# EAGLE design SIC (EAGLE 7.2.0)
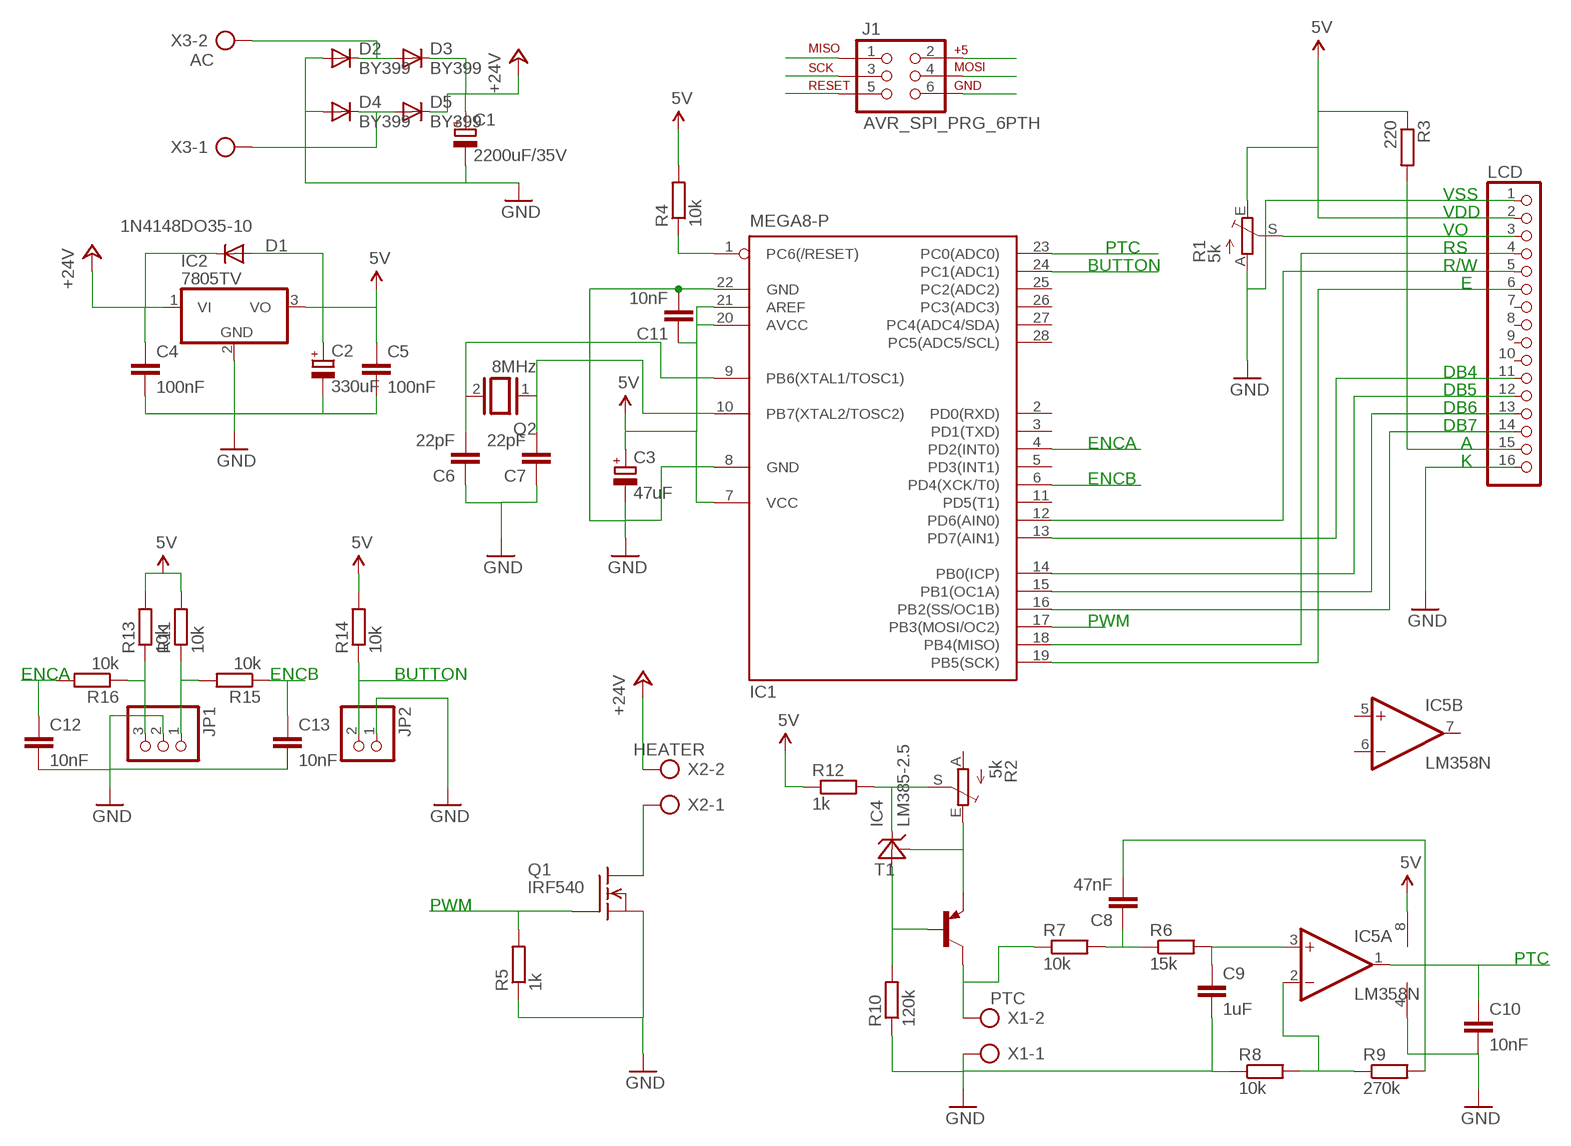
[diagram p0: schematic, sheet 1]

## Parts
C1  2200uF/35V  CPOL-EUE7.5-16  [E7,5-16]
C2  330uF  CPOL-EUE3.5-8  [E3,5-8]
C3  47uF  CPOL-EUE2-5  [E2-5]
C4  100nF  C-EU050-025X075  [C050-025X075]
C5  100nF  C-EU050-025X075  [C050-025X075]
C6  22pF  C-EU050-024X044  [C050-024X044]
C7  22pF  C-EU050-024X044  [C050-024X044]
C8  47nF  C-EU050-025X075  [C050-025X075]
C9  1uF  C-EU050-030X075  [C050-030X075]
C10  10nF  C-EU050-025X075  [C050-025X075]
C11  10nF  C-EU050-025X075  [C050-025X075]
C12  10nF  C-EU050-025X075  [C050-025X075]
C13  10nF  C-EU050-025X075  [C050-025X075]
D1  1N4148DO35-10  [DO35-10]
D2  BY399  BY396  [DO201-15]
D3  BY399  BY396  [DO201-15]
D4  BY399  BY396  [DO201-15]
D5  BY399  BY396  [DO201-15]
IC1  MEGA8-P  [DIL28-3]
IC2  7805TV  [TO220V]
IC4  LM385-2.5  [TO92-]
IC5  LM358N  [DIL08]
J1  AVR_SPI_PRG_6PTH  [2X3]
JP1  PINHD-1X3  [1X03]
JP2  PINHD-1X2  [1X02]
LCD  PINHD-1X16  [1X16]
Q1  IRF540  [TO220]
Q2  8MHz  XTAL/S  [QS]
R1  5k  TRIM_EU-LI10  [LI10]
R2  5k  TRIM_EU-LI10  [LI10]
R3  220  R-EU_0207/10  [0207/10]
R4  10k  R-EU_0207/10  [0207/10]
R5  1k  R-EU_0207/10  [0207/10]
R6  15k  R-EU_0207/10  [0207/10]
R7  10k  R-EU_0207/10  [0207/10]
R8  10k  R-EU_0207/10  [0207/10]
R9  270k  R-EU_0207/10  [0207/10]
R10  120k  R-EU_0207/10  [0207/10]
R11  10k  R-EU_0207/10  [0207/10]
R12  1k  R-EU_0207/10  [0207/10]
R13  10k  R-EU_0207/10  [0207/10]
R14  10k  R-EU_0207/10  [0207/10]
R15  10k  R-EU_0207/10  [0207/10]
R16  10k  R-EU_0207/10  [0207/10]
T1  BC327-16-PNP-TO92-EBC  [TO92-EBC]
X1  PTC  AK300/2  [AK300/2]
X2  HEATER  AK300/2  [AK300/2]
X3  AC  AK300/2  [AK300/2]

## Nets
5V: C2.+ C3.+ C5.1 C11.1 D1.A IC1.7(VCC) IC1.20(AVCC) IC1.21(AREF) IC2.3(VO) IC5.8(P:V+) J1.2 LCD.2 R1.E R3.1 R4.2 R11.2 R12.1 R13.2 R14.2
+24V: C1.+ C4.1 D1.C D3.C D5.C IC2.1(VI) X2.2
BUTTON: IC1.24(PC1(ADC1)) JP2.2 R14.1
ENCA: C12.1 IC1.4(PD2(INT0)) R16.2
ENCB: C13.1 IC1.6(PD4(XCK/T0)) R15.1
GND: C1.- C2.- C3.- C4.2 C5.2 C6.1 C7.1 C9.2 C10.2 C11.2 C12.2 C13.2 D2.A D4.A IC1.8(GND) IC1.22(GND) IC2.2(GND) IC5.4(P:V-) J1.6 JP1.2 JP2.1 LCD.1 LCD.16 Q1.3(S) R1.A R5.1 R8.1 R10.1 X1.1
MISO: IC1.18(PB4(MISO)) J1.1 LCD.4
MOSI_PWM: IC1.17(PB3(MOSI/OC2)) J1.4 Q1.1(G) R5.2
N$1: IC1.13(PD7(AIN1)) LCD.11
N$2: IC1.14(PB0(ICP)) LCD.12
N$3: IC1.15(PB1(OC1A)) LCD.13
N$4: IC1.16(PB2(SS/OC1B)) LCD.14
N$5: LCD.15 R3.2
N$7: C8.1 R6.1 R7.2
N$8: C9.1 IC5.3(A:+IN) R6.2
N$9: Q1.2(D) X2.1
N$10: LCD.3 R1.S
N$11: IC5.2(A:-IN) R8.2 R9.1
N$13: JP1.3 R13.1 R16.1
N$14: D4.C D5.A X3.1
N$15: D2.C D3.A X3.2
N$16: R7.1 T1.C X1.2
N$17: IC4.3(FB) R2.E T1.E
N$18: JP1.1 R11.1 R15.2
N$19: C6.2 IC1.9(PB6(XTAL1/TOSC1)) Q2.2
N$20: C7.2 IC1.10(PB7(XTAL2/TOSC2)) Q2.1
N$21: IC1.12(PD6(AIN0)) LCD.5
N$24: IC4.1(A) R10.2 T1.B
N$25: IC4.2(C) R2.S R12.2
PTC: C8.2 C10.1 IC1.23(PC0(ADC0)) IC5.1(A:OUT) R9.2
RESET: IC1.1(PC6(/RESET)) J1.5 R4.1
SCK: IC1.19(PB5(SCK)) J1.3 LCD.6
Unconnected: IC1.2(PD0(RXD)) IC1.3(PD1(TXD)) IC1.5(PD3(INT1)) IC1.11(PD5(T1)) IC1.25(PC2(ADC2)) IC1.26(PC3(ADC3)) IC1.27(PC4(ADC4/SDA)) IC1.28(PC5(ADC5/SCL)) IC5.5(B:+IN) IC5.6(B:-IN) IC5.7(B:OUT) LCD.7 LCD.8 LCD.9 LCD.10 R2.A

## Notes on the sheet
- VSS
- VDD
- VO
- PTC | RS
- BUTTON | R/W
- E
- DB4
- DB5
- DB6
- DB7
- ENCA | A
- K
- ENCB
- PWM
- ENCA | ENCB | BUTTON
- PWM
- PTC

## Library data of the parts
C1-C3 = rcl:CPOL-EU: POLARIZED CAPACITOR, European symbol
C4-C13 = rcl:C-EU: CAPACITOR, European symbol
D1 = diode:1N4148: DIODE high speed (Philips)
D2-D5 = diode:BY396: DIODE Si,100 V, 3 A
IC1 = atmel:MEGA8-P: MICROCONTROLLER 8 Kbytes FLASH, 1 kbytes SRAM, 512 bytes EEPROM, USART, 4-channel 10 bit ADC, 2-channel 8 bit ADC Pin compatible with Atmega48, ATMega88, ATMega168 Source: avr.lbr; OC_FARNELL: unknown; OC_NEWARK: unknown
IC2 = linear:78*: Positive VOLTAGE REGULATOR Source: http://cache.national.com/ds/LM/LM78L05.pdf http://www.fairchildsemi.com/ds/LM/LM7805.pdf
IC4 = oli:LM385*: LM185/285/385 Adjustable Micropower Voltage Reference Features Adjustable from 1.24 V to 5.30 V Operating current of 10 µA to 20 mA 1 % and 2 % initial tolerance 1 Ω dynamic impedance Low temperature coefficient
IC5 = linear:LM358: OP AMP also LM158; LM258; LM2904 Source: http://cache.national.com/ds/LM/LM158.pdf
J1 = SparkFun:AVR_SPI_PRG_6: AVR ISP 6 Pin This is the reduced ISP connector for AVR programming. Common on Arduino. This footprint will take up less PCB space and can be used with a 10-pin to 6-pin adapter such as SKU: BOB-08508
JP1 = pinhead:PINHD-1X3: PIN HEADER
JP2 = pinhead:PINHD-1X2: PIN HEADER
LCD = pinhead:PINHD-1X16: PIN HEADER
Q1 = transistor-fet:IRF540: N-Channel Enhancement MOSFET (HEXFET); 100V; 28A; 0,077Ohm
Q2 = special:XTAL/S: CRYSTAL
R1 R2 = pot:TRIM_EU-: POTENTIOMETER
R3-R16 = resistor:R-EU_: RESISTOR, European symbol
T1 = transistor:*-PNP-: PNP Transistror
X1-X3 = con-ptr500:AK300/2: CONNECTOR; OC_FARNELL: unknown; OC_NEWARK: unknown

## Board
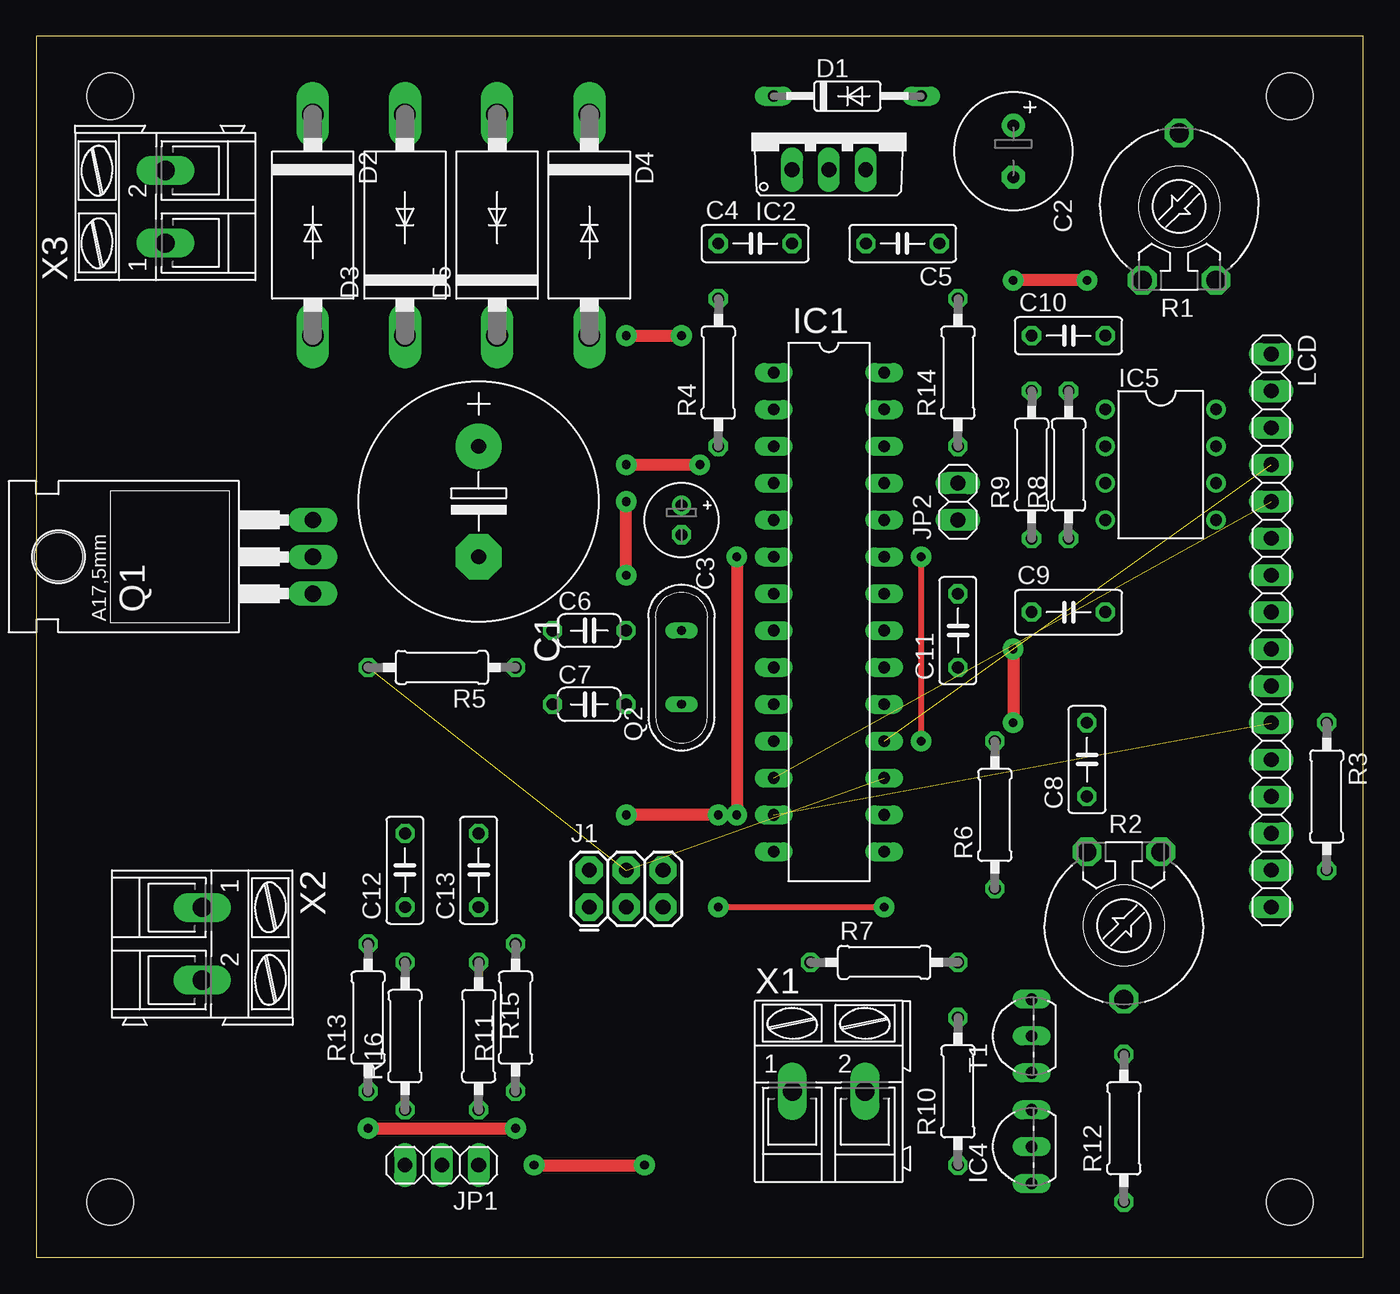
[diagram p1: board, top side]
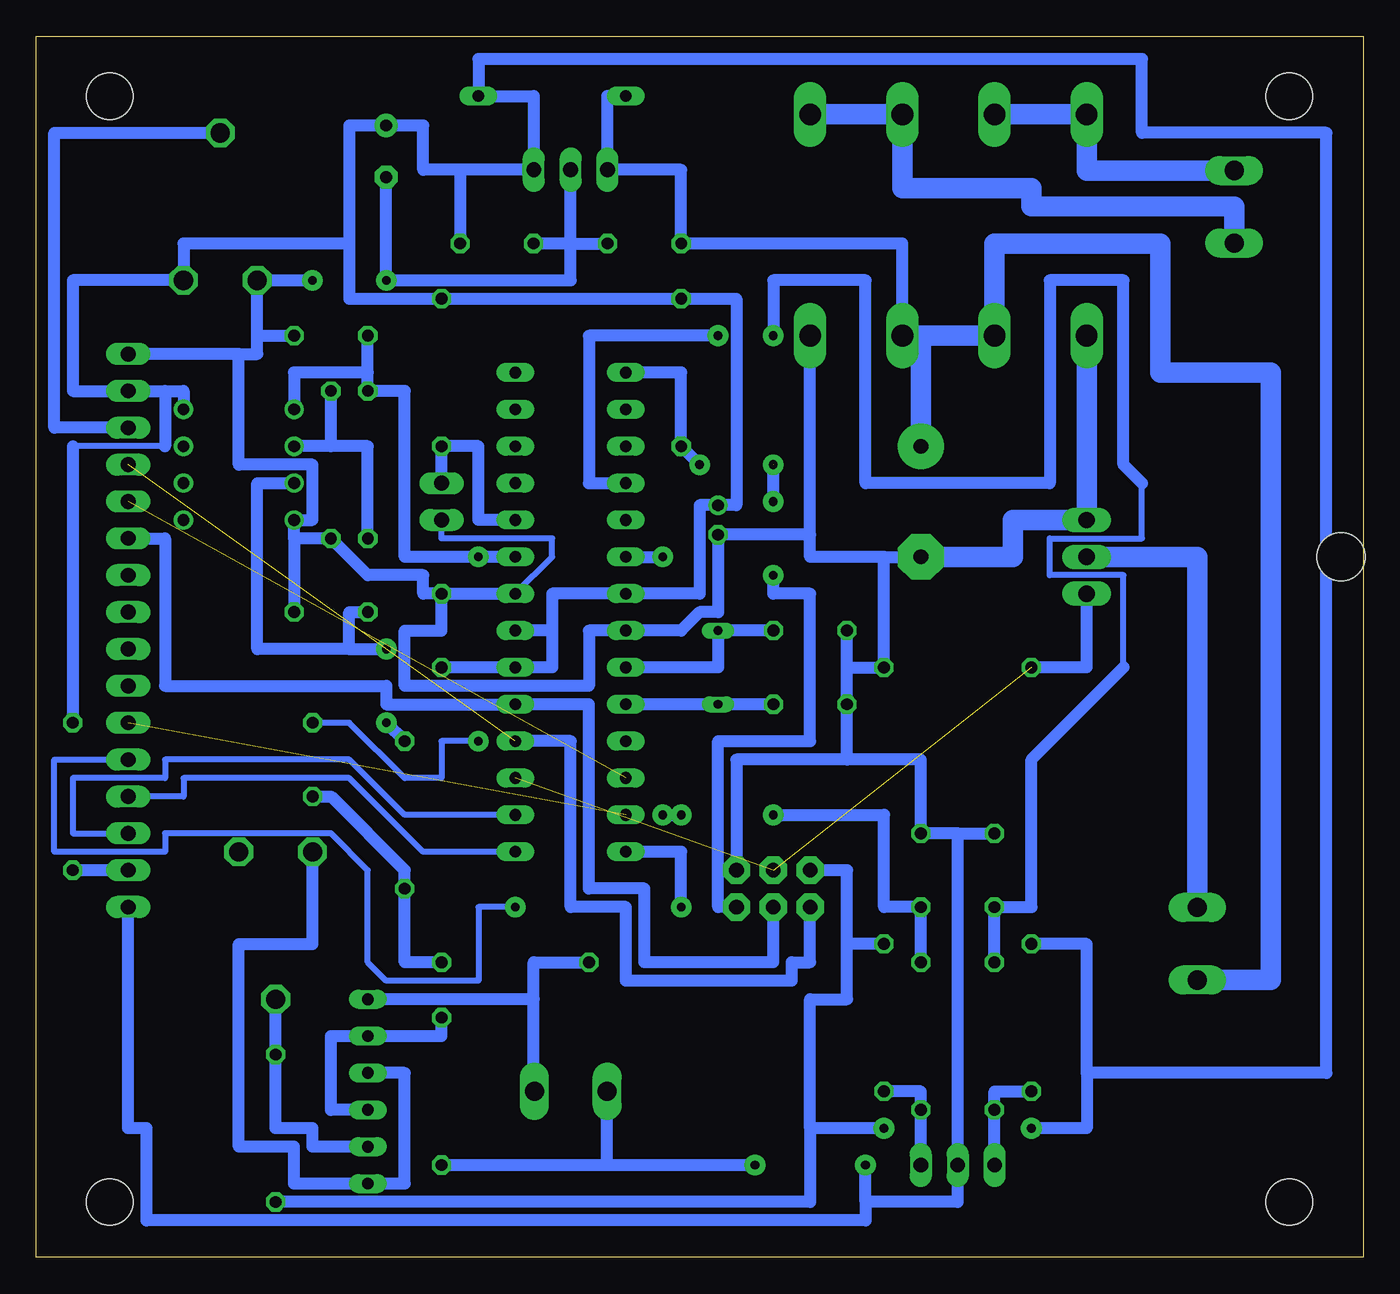
[diagram p2: board, bottom side, seen from below]

Size 91.42 x 84.12 mm. Coordinates in mm from the lower left corner, seen from the top.
Outline: 0,0 91.42,0 91.42,84.12 0,84.12 0,0
Copper layers (1*16): Top 0.035mm / dielectric 1.5mm / Bottom 0.035mm
Design rules "default": minimum track width 10mil, minimum drill 24mil, track to track 8mil, track to pad 8mil, pad to pad 8mil, via to via 8mil, smd to smd 8mil, copper to edge 40mil, drill to drill 8mil, minimum pad ring 10mil, minimum via ring 8mil, stop-mask expansion 4mil, vias tented up to drill 0mil, thermal gap 10mil
Holes 3.2 mm at 5.08,3.81 5.08,80.01 86.36,3.81 86.36,80.01

### Footprints (pad centres in the part's own frame; a part is rotated, then mirrored left to right if it is on the bottom)
E7,5-16 = drill 1.016 pad 3.15: + -3.81,0 | drill 1.016 pad 3.15 octagon: - 3.81,0
E3,5-8 = drill 0.813 pad 1.6: + -1.778,0 | drill 0.813 pad 1.6 octagon: - 1.778,0
E2-5 = drill 0.813 pad 1.27: + -1.016,0 | drill 0.813 pad 1.27 octagon: - 1.016,0
C050-025X075 = drill 0.813 octagon: 1 -2.54,0; 2 2.54,0
C050-024X044 = drill 0.813 octagon: 1 -2.54,0; 2 2.54,0
C050-030X075 = drill 0.813 octagon: 1 -2.54,0; 2 2.54,0
DO35-10 = drill 0.813 long: A 5.08,0; C -5.08,0
DO201-15 = drill 1.499 long: A 7.62,0; C -7.62,0
DIL28-3 = drill 0.813 long: 1 -16.51,-3.81; 2 -13.97,-3.81; 3 -11.43,-3.81; 4 -8.89,-3.81; 5 -6.35,-3.81; 6 -3.81,-3.81; 7 -1.27,-3.81; 8 1.27,-3.81; 9 3.81,-3.81; 10 6.35,-3.81; 11 8.89,-3.81; 12 11.43,-3.81; 13 13.97,-3.81; 14 16.51,-3.81; 15 16.51,3.81; 16 13.97,3.81; 17 11.43,3.81; 18 8.89,3.81; 19 6.35,3.81; 20 3.81,3.81; 21 1.27,3.81; 22 -1.27,3.81; 23 -3.81,3.81; 24 -6.35,3.81; 25 -8.89,3.81; 26 -11.43,3.81; 27 -13.97,3.81; 28 -16.51,3.81
TO220V = drill 1.016 long: 1 -2.54,-2.54; 2 0,-2.54; 3 2.54,-2.54
TO92- = drill 0.813 long: 1 2.54,0; 2 0,0; 3 -2.54,0
DIL08 = drill 0.813 pad 1.27: 1 -3.81,-3.81; 2 -1.27,-3.81; 3 1.27,-3.81; 4 3.81,-3.81; 5 3.81,3.81; 6 1.27,3.81; 7 -1.27,3.81; 8 -3.81,3.81
2X3 = drill 1.016 pad 1.88 octagon: 1 0,0; 2 0,2.54; 3 2.54,0; 4 2.54,2.54; 5 5.08,0; 6 5.08,2.54
1X03 = drill 1.016 long: 1 -2.54,0; 2 0,0; 3 2.54,0
1X02 = drill 1.016 long: 1 -1.27,0; 2 1.27,0
1X16 = drill 1.016 long: 1 -19.05,0; 2 -16.51,0; 3 -13.97,0; 4 -11.43,0; 5 -8.89,0; 6 -6.35,0; 7 -3.81,0; 8 -1.27,0; 9 1.27,0; 10 3.81,0; 11 6.35,0; 12 8.89,0; 13 11.43,0; 14 13.97,0; 15 16.51,0; 16 19.05,0
TO220 = drill 1.118 long: 1 -2.54,-6.35; 2 0,-6.35; 3 2.54,-6.35 | hole 3.302: 0,11.176
QS = drill 0.61 long: 1 -2.54,0; 2 2.54,0
LI10 = drill 1.321 octagon: A -2.54,-5.08; E 2.54,-5.08; S 0,5.08
0207/10 = drill 0.813 octagon: 1 -5.08,0; 2 5.08,0
TO92-EBC = drill 0.813 long: B 0,-1.27; C 2.54,-1.27; E -2.54,-1.27
AK300/2 = drill 1.321 long: 1 -2.515,0; 2 2.489,0

### Placement (x,y rotation side)
C1  30.48,52.07 270 top
C2  67.31,76.2 270 top
C3  44.45,50.8 270 top
C4  49.53,69.85 0 top
C5  59.69,69.85 180 top
C6  38.1,43.18 0 top
C7  38.1,38.1 0 top
C8  72.39,34.29 90 top
C9  71.12,44.45 0 top
C10  71.12,63.5 0 top
C11  63.5,43.18 90 top
C12  25.4,26.67 90 top
C13  30.48,26.67 90 top
D1  55.88,80.01 0 top
D2  19.05,71.12 270 top
D3  25.4,71.12 90 top
D4  38.1,71.12 270 top
D5  31.75,71.12 90 top
IC1  54.61,44.45 270 top
IC2  54.61,77.47 0 top
IC4  68.58,7.62 90 top
IC5  77.47,54.61 270 top
J1  38.1,24.13 0 top
JP1  27.94,6.35 180 top
JP2  63.5,52.07 90 top
LCD  85.09,43.18 270 top
Q1  12.7,48.26 90 top
Q2  44.45,40.64 90 top
R1  78.74,72.39 0 top
R2  74.93,22.86 180 top
R3  88.9,31.75 270 top
R4  46.99,60.96 90 top
R5  27.94,40.64 180 top
R6  66.04,30.48 90 top
R7  58.42,20.32 0 top
R8  71.12,54.61 90 top
R9  68.58,54.61 90 top
R10  63.5,11.43 90 top
R11  33.02,16.51 90 top
R12  74.93,8.89 90 top
R13  22.86,16.51 90 top
R14  63.5,60.96 90 top
R15  30.48,15.24 270 top
R16  25.4,15.24 90 top
T1  67.31,15.24 90 top
X1  54.61,11.43 0 top
X2  11.43,21.59 270 top
X3  8.89,72.39 90 top

### Tracks (layer width: path | path; a pad name or v marks a point on that pad's centre or on a via)
5V  (via drill 0.6 pad 1.42)
  Top 0.813: v22.86,8.89 v33.02,8.89
  Bottom 0.406: 82.55,55.88 88.9,55.88
  Bottom 0.813: 55.88,43.18 55.88,45.72 IC1.7 45.72,45.72 45.72,51.82 C3.+ 43.18,51.82 43.18,66.04 R4.2 R14.2 69.85,66.04 69.85,69.85 | 55.88,43.18 IC1.21 | 55.88,43.18 55.88,40.64 IC1.20 C11.1 | 62.23,74.93 IC2.3 57.15,80.01 D1.A 60.96,82.55 15.24,82.55 15.24,77.47 2.54,77.47 2.54,12.7 19.05,12.7 | 62.23,74.93 C5.1 | 62.23,74.93 64.77,74.93 64.77,77.98 C2.+ 69.85,77.98 69.85,69.85 | 82.55,59.69 LCD.2 88.9,59.69 88.9,67.31 R1.E 81.28,69.85 69.85,69.85 | 82.55,59.69 81.28,59.69 IC5.8 | R12.1 38.1,3.81 38.1,8.89 | 38.1,8.89 38.1,17.78 35.56,17.78 35.56,21.59 | 35.56,21.59 35.56,26.67 J1.2 | R11.2 35.56,21.59 | 88.9,55.88 R3.1 | 82.55,59.69 82.55,55.88 | 19.05,12.7 19.05,8.89 v22.86,8.89 | v33.02,8.89 38.1,8.89 | 19.05,12.7 19.05,17.78 19.05,21.59 R13.2
+24V
  Bottom 0.813: 30.48,63.5 D5.C 31.75,69.85 C4.1 46.99,74.93 IC2.1 52.07,80.01 D1.C
  Bottom 1.422: D5.C D3.C 25.4,69.85 13.97,69.85 13.97,60.96 6.35,60.96 6.35,19.1 X2.2 | 30.48,63.5 C1.+
BUTTON
  Bottom 0.813: JP2.2 R14.1 60.96,55.88 60.96,50.8 IC1.24
ENCA  (via drill 0.6 pad 1.42)
  Top 0.813: v40.64,63.5 v44.45,63.5
  Bottom 0.406: 16.51,40.64 16.51,46.99 21.59,46.99 21.59,49.53 15.24,49.53 15.24,53.34
  Bottom 0.813: R16.2 C12.1 22.86,24.13 22.86,34.29 16.51,40.64 | 15.24,53.34 16.51,54.61 16.51,67.31 21.59,67.31 21.59,53.34 34.29,53.34 34.29,67.31 40.64,67.31 v40.64,63.5 | IC1.4 53.34,53.34 53.34,63.5 v44.45,63.5
ENCB  (via drill 0.6 pad 1.42)
  Top 0.813: v48.26,48.26 v48.26,30.48 | v46.99,30.48 v40.64,30.48
  Bottom 0.813: R15.1 C13.1 33.02,24.13 33.02,30.48 v40.64,30.48 | IC1.6 v48.26,48.26 | v48.26,30.48 v46.99,30.48
GND  (via drill 0.6 pad 1.42)
  Top 0.813: v72.39,67.31 v67.31,67.31 | v34.29,6.35 v41.91,6.35
  Bottom 0.406: JP2.1 63.5,49.53 55.88,49.53 55.88,48.26 IC1.22
  Bottom 0.813: 35.56,40.64 C7.1 35.56,34.29 | 35.56,40.64 C6.1 | 38.1,49.78 D4.A | 33.02,48.26 C1.- | 35.56,40.64 R5.1 33.02,48.26 | 33.02,48.26 38.1,48.26 38.1,49.78 | 38.1,49.78 C3.- 44.45,44.45 45.72,44.45 46.99,43.18 IC1.8 53.34,43.18 53.34,39.37 66.04,39.37 66.04,43.18 63.5,43.18 C11.2 | 54.61,69.85 C4.2 | 54.61,69.85 IC2.2 | 54.61,69.85 C5.2 | C2.- v67.31,67.31 54.61,67.31 54.61,69.85 | C11.2 IC1.22 | 73.66,49.53 R8.1 68.58,46.99 64.77,46.99 64.77,45.72 C11.2 | 76.2,63.5 C10.2 | 76.2,63.5 R1.A v72.39,67.31 | 77.47,62.23 76.2,62.23 76.2,63.5 | 77.47,62.23 LCD.1 | 73.66,49.53 IC5.4 72.39,50.8 72.39,54.61 77.47,54.61 77.47,62.23 | 73.66,49.53 C9.2 | 27.94,29.21 JP1.2 27.94,3.81 34.29,3.81 | 27.94,29.21 C12.2 | 27.94,29.21 C13.2 30.48,34.29 35.56,34.29 | 52.09,6.35 R10.1 | 52.09,6.35 X1.1 | J1.6 43.18,34.29 35.56,34.29 | 34.29,3.81 v34.29,6.35 | LCD.16 85.09,8.89 83.82,8.89 83.82,2.54 34.29,2.54 34.29,3.81 | v41.91,6.35 52.09,6.35
  Bottom 1.422: D2.A Q1.3 24.13,50.8 24.13,48.26 C1.-
MISO  (1 unrouted)
  Bottom 0.813: IC1.18 54.61,35.56 54.61,24.13 50.8,24.13 50.8,19.05 39.37,19.05 39.37,20.32 38.1,20.32 J1.1
MOSI_PWM  (2 unrouted)
  Bottom 0.813: R5.2 19.05,40.64 Q1.1
N$1  (1 unrouted)
N$2  (via drill 0.6 pad 1.42)
  Top 0.406: v46.99,24.13 v58.42,24.13
  Bottom 0.406: LCD.12 90.17,34.29 90.17,27.94 82.55,27.94 82.55,29.21 71.12,29.21 68.58,26.67 68.58,20.32 67.31,19.05 60.96,19.05 60.96,24.13 v58.42,24.13
  Bottom 0.813: IC1.14 46.99,27.94 v46.99,24.13
N$3
  Bottom 0.406: IC1.15 64.77,27.94 69.85,33.02 81.28,33.02 81.28,31.75 LCD.13
N$4
  Bottom 0.406: IC1.16 66.04,30.48 69.85,34.29 82.55,34.29 82.55,33.02 88.9,33.02 88.9,29.21 LCD.14
N$5
  Bottom 0.813: LCD.15 R3.2
N$6  (via drill 0.6 pad 1.42)
  other vias: 40.64,52.07
N$7
  Bottom 0.813: R7.2 66.04,20.32 R6.1 66.04,26.67 71.12,31.75 C8.1
N$8  (via drill 0.6 pad 1.42)
  Top 0.813: v67.31,41.91 v67.31,36.83
  Bottom 0.813: IC5.3 76.2,53.34 76.2,41.91 69.85,41.91 | 69.85,41.91 69.85,44.45 C9.1 | R6.2 v67.31,36.83 | 69.85,41.91 v67.31,41.91
N$9
  Bottom 1.422: Q1.2 11.43,48.26 X2.1
N$10
  Bottom 0.813: R1.S 90.17,77.47 90.17,57.15 LCD.3
N$11
  Bottom 0.813: R9.1 68.58,55.88 71.12,55.88 | 71.12,55.88 IC5.2 | 71.12,55.88 R8.2
N$12  (via drill 0.6 pad 1.42)
  other vias: 40.64,54.61
N$13
  Bottom 0.813: R13.1 25.4,11.43 R16.1 JP1.3
N$14
  Bottom 1.422: X3.1 8.89,72.39 22.86,72.41 22.86,73.66 31.75,73.66 D5.A D4.C
N$15
  Bottom 1.422: X3.2 19.05,74.88 D2.C D3.A
N$16
  Bottom 0.813: X1.2 57.15,11.43 57.15,17.78 | 57.15,17.78 57.15,20.32 R7.1 | 57.15,17.78 T1.C
N$17
  Bottom 0.813: T1.E 66.04,12.7 66.04,5.08 IC4.3 73.66,5.08 73.66,7.62 77.47,7.62 77.47,21.59 72.39,21.59 R2.E
N$18
  Bottom 0.813: JP1.1 R15.2 30.48,11.43 R11.1
N$19
  Bottom 0.813: IC1.9 44.45,40.64 Q2.2 C6.2
N$20
  Bottom 0.813: IC1.10 Q2.1 C7.2
N$21  (1 unrouted)
N$22  (via drill 0.6 pad 1.42)
  other vias: 67.31,41.91
N$24
  Bottom 0.813: R10.2 63.5,15.24 T1.B 71.12,15.24 71.12,10.16 IC4.1
N$25
  Bottom 0.813: R2.S R12.2 74.93,8.89 72.39,8.89 72.39,7.62 IC4.2
PTC  (via drill 0.6 pad 1.42)
  Top 0.406: v60.96,48.26 v60.96,35.56
  Bottom 0.406: C8.2 69.85,36.83 66.04,33.02 63.5,33.02 63.5,35.56 v60.96,35.56
  Bottom 0.813: IC1.23 v60.96,48.26 66.04,48.26 66.04,59.69 R9.2 68.58,60.96 | 68.58,60.96 C10.1 | IC5.1 73.66,60.96 68.58,60.96
RESET  (via drill 0.6 pad 1.42)  (1 unrouted)
  Top 0.813: 40.64,54.61 v45.72,54.61 | v40.64,46.99 v40.64,52.07
  Bottom 0.813: IC1.1 46.99,60.96 R4.1 v45.72,54.61 | J1.5 44.45,24.13 44.45,35.56 38.1,35.56 38.1,45.72 40.64,45.72 v40.64,46.99 | v40.64,52.07 40.64,54.61
SCK
  Bottom 0.813: J1.3 40.64,20.32 49.53,20.32 49.53,25.4 53.34,25.4 53.34,38.1 IC1.19 67.31,38.1 67.31,39.37 82.55,39.37 82.55,49.53 LCD.6